# Altium schematic sheet Sheet3.SchDoc
size A4
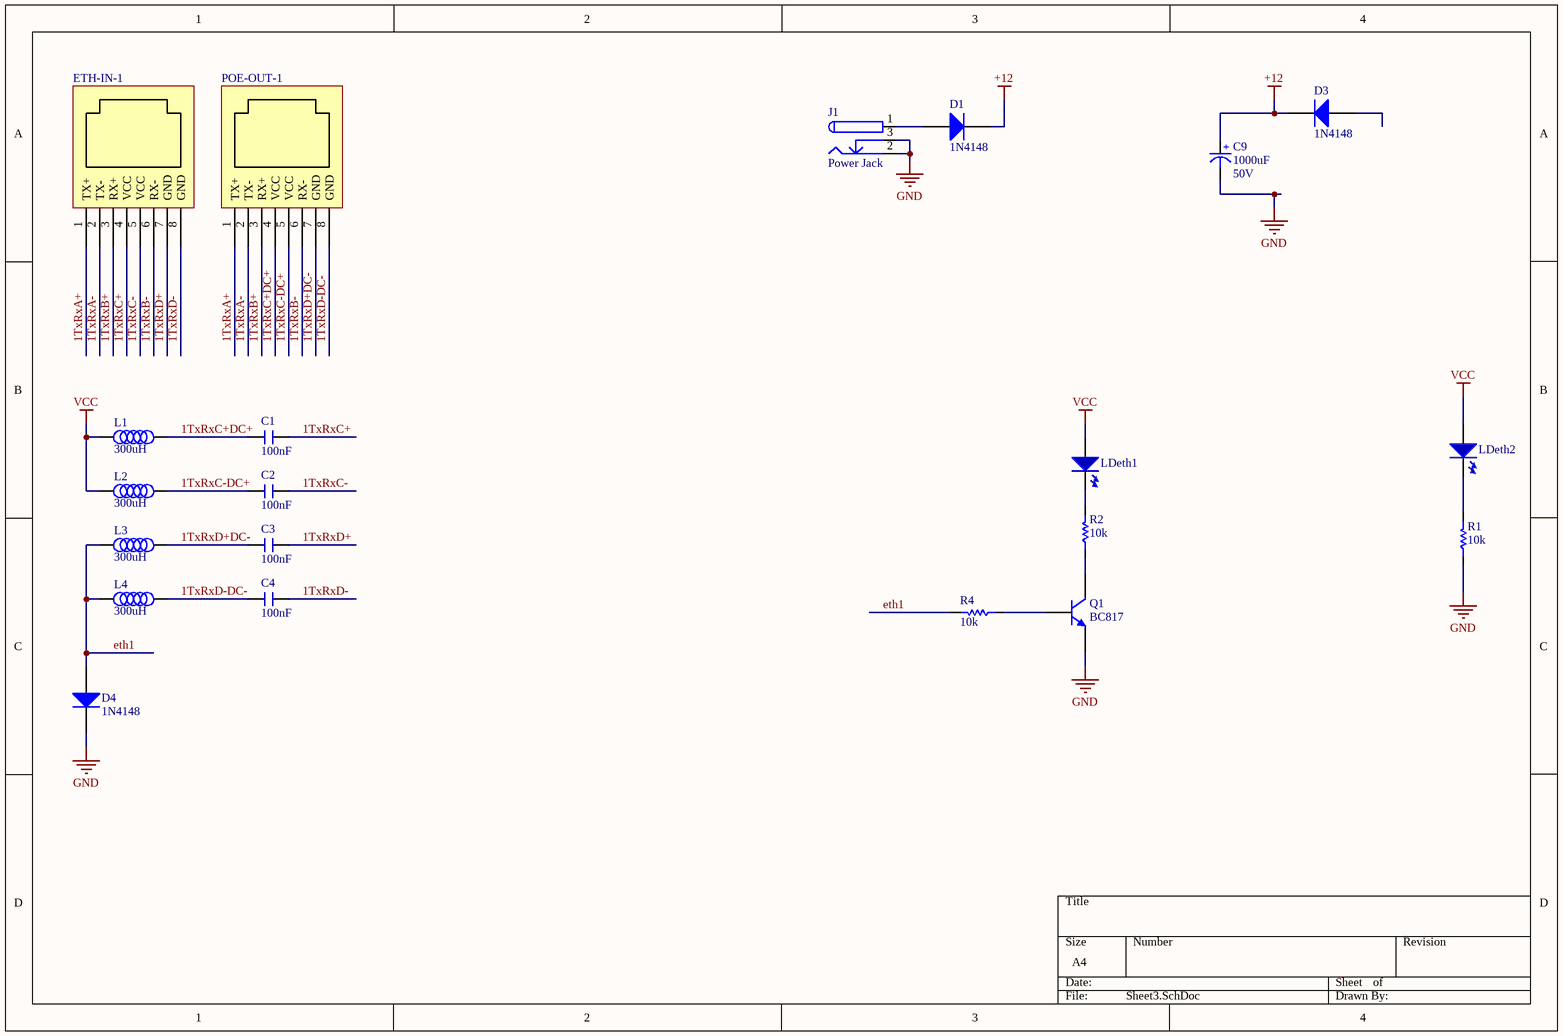
[diagram p0: Sheet3.SchDoc]

## Parts
C1  Capacitor SMD  [1206 Capacitor]  (value not drawn)
C2  Capacitor SMD  [1206 Capacitor]  (value not drawn)
C3  Capacitor SMD  [1206 Capacitor]  (value not drawn)
C4  Capacitor SMD  [1206 Capacitor]  (value not drawn)
C9  Voltage: 50V  [CAP 05]  (hidden comment: 1000uF)
D1  1N4148  [LL4148]
D3  1N4148  [LL4148]
D4  1N4148  [LL4148]
ETH-IN-1  RJ45-w57-1  [rj45-hb]  (value not drawn)
J1  Power Jack  [Power Jack]
L1  300uH  [inductor]
L2  300uH  [inductor]
L3  300uH  [inductor]
L4  300uH  [inductor]
LDeth1  SMD LED  [LED 1 X  3mm GREEN RIGHT ANGLE]  (value not drawn)
LDeth2  SMD LED  [LED 1 X  3mm GREEN RIGHT ANGLE]  (value not drawn)
POE-OUT-1  RJ45-w57-1  [rj45-hb]  (value not drawn)
Q1  BC817  [SOT-23]
R1  10k  [RES 1206 (3216X08L)]
R2  10k  [RES 1206 (3216X08L)]
R4  10k  [RES 1206 (3216X08L)]

## Nets
+12: C9.1(+) D1.2(K) D3.2(K)
GND: C9.2(-) D4.2(K) J1.2 J1.3 Q1.2(E) R1.1
VCC: L1.1 L2.1 LDeth1.1(A) LDeth2.1(A)
1TxRxA+: ETH-IN-1.1(TX+) POE-OUT-1.1(TX+)
1TxRxA-: ETH-IN-1.2(TX-) POE-OUT-1.2(TX-)
1TxRxB+: ETH-IN-1.3(RX+) POE-OUT-1.3(RX+)
1TxRxB-: ETH-IN-1.6(RX-) POE-OUT-1.6(RX-)
1TxRxC+: C1.2 ETH-IN-1.4(VCC)
1TxRxC+DC+: C1.1 L1.2 POE-OUT-1.4(VCC)
1TxRxC-: C2.2 ETH-IN-1.5(VCC)
1TxRxC-DC+: C2.1 L2.2 POE-OUT-1.5(VCC)
1TxRxD+: C3.2 ETH-IN-1.7(GND)
1TxRxD+DC-: C3.1 L3.2 POE-OUT-1.7(GND)
1TxRxD-: C4.2 ETH-IN-1.8(GND)
1TxRxD-DC-: C4.1 L4.2 POE-OUT-1.8(GND)
eth1: D4.1(A) L3.1 L4.1 R4.2
NetD1_1: D1.1(A) J1.1
NetLDeth1_2: LDeth1.2(K) R2.2
NetLDeth2_2: LDeth2.2(K) R1.2
NetQ1_1: Q1.1(B) R4.1
NetQ1_3: Q1.3(C) R2.1

Not connected (* = marked no-connect by the designer): D3 1(A)

## Notes on the sheet
- (in symbol Capacitor SMD) 100nF

## Library data of the parts
C9 = Cap-Polar: Polar Capacitor; Designer: Saeid Jorablo; Organazation: ControTec; Adding Date: 1387/12/20; Value: 1000uF
D1 D3 D4 = Diode 1N4148: High Conductance Fast Diode; Published: 8-Jun-2000; LatestRevisionDate: 17-Jul-2002; LatestRevisionNote: Re-released for DXP Platform.; DatasheetVersion: 1997; PackageReference: DO-35; Publisher: Altium Limited; PackageDescription: Diode, Axial; Body 3.8 x 1.9 mm (LxDia. max), Lead Dia. 0.53 mm (max); Code_JEDEC: DO-204-AH; ComponentLink1Description: Manufacturer Link; ComponentLink1URL: http://www.fairchildsemi.com/; ComponentLink2Description: Datasheet; ComponentLink2URL: http://www.fairchildsemi.com/ds/1N%2F1N4148.pdf
J1 = Power Jack: Designer: Saeid Jorablo; Company: Personal; Project Name: Laser; Adding Date: 10/21/2009
L1-L4 = Inductor SMT
LDeth1 LDeth2 = LED SMD
R1 R2 R4 = Resistor: Tolerance: 5%; Power: 1/8 W; Value: 10k